# EAGLE design zilla1 (EAGLE 7.2.0)
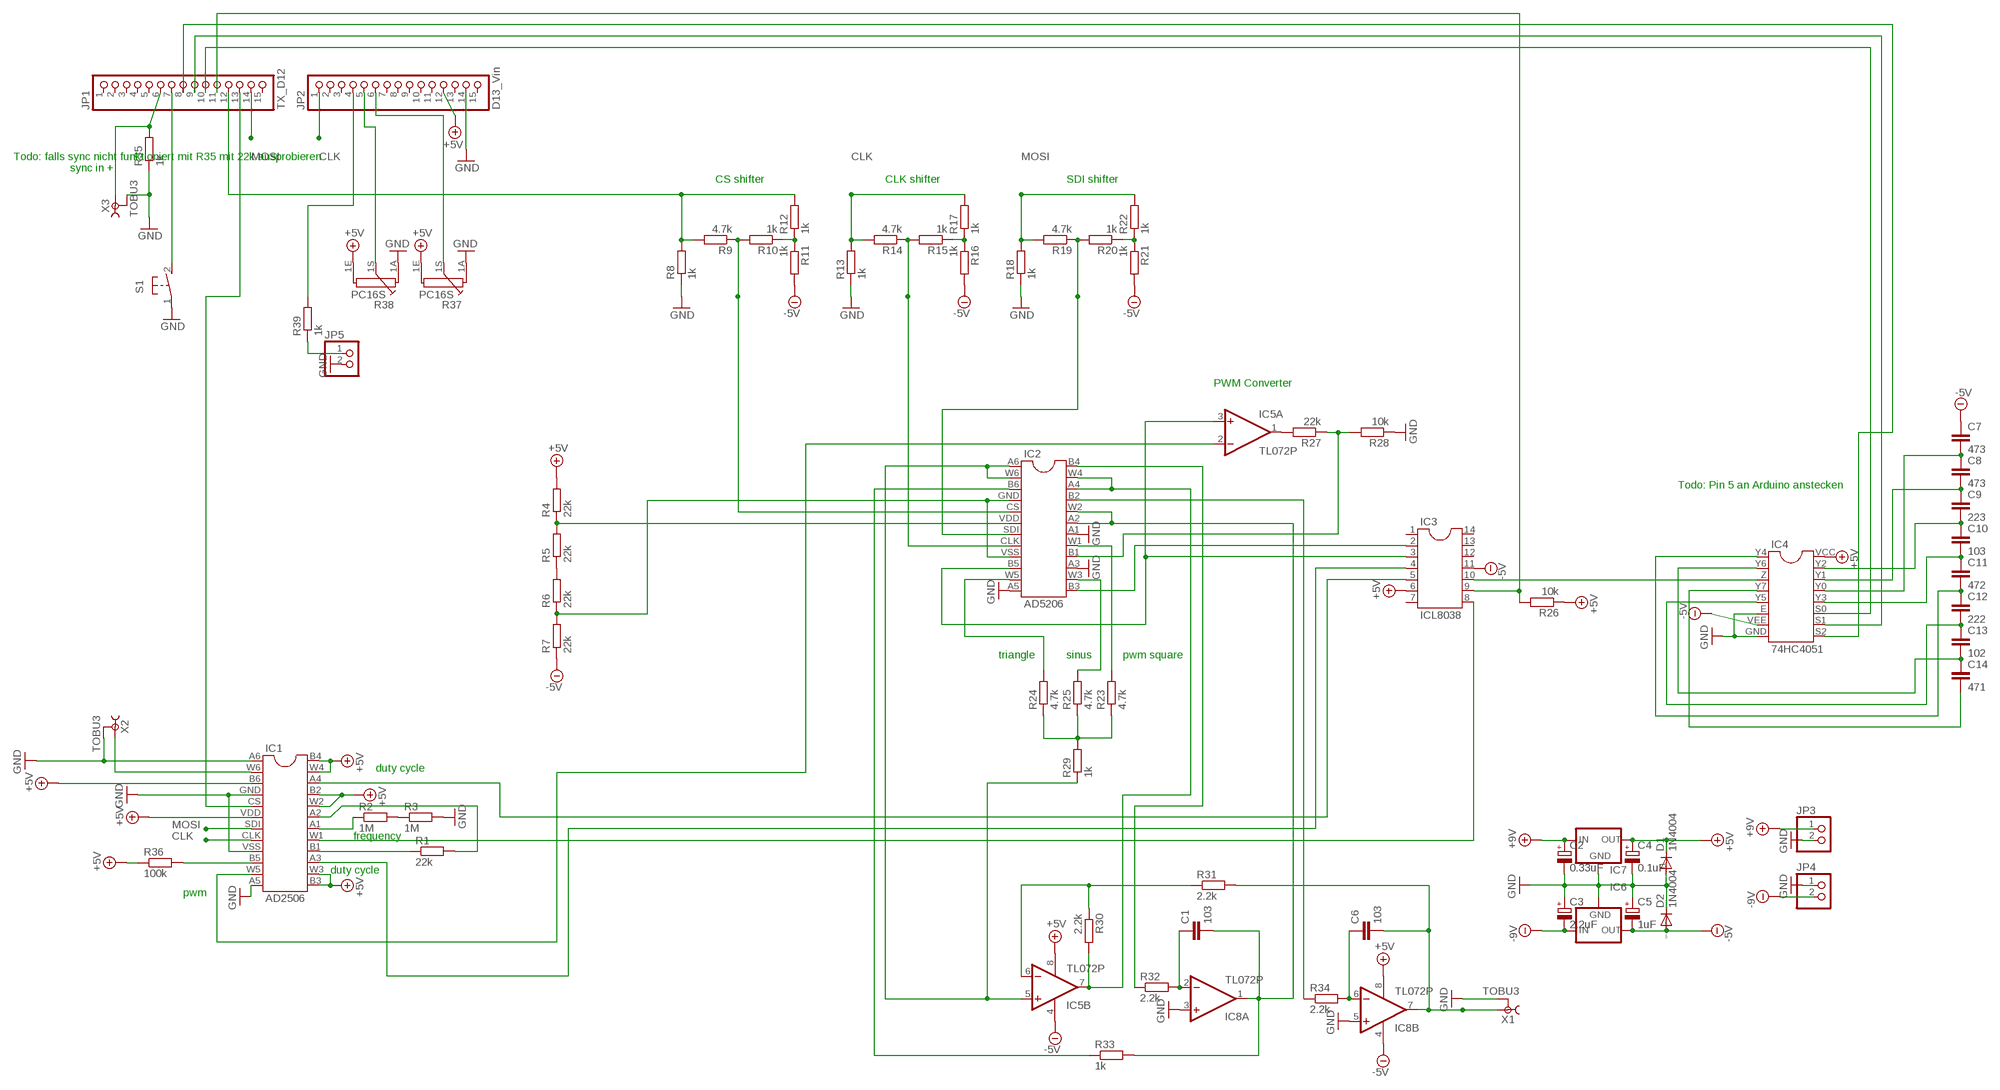
[diagram p0: schematic, sheet 1]

## Parts
C1  103  C-EU025-024X044  [C025-024X044]
C2  0.33uF  CPOL-EUE2-5  [E2-5]
C3  2.2uF  CPOL-EUE2-5  [E2-5]
C4  0.1uF  CPOL-EUE2-5  [E2-5]
C5  1uF  CPOL-EUE2-5  [E2-5]
C6  103  C-EU025-024X044  [C025-024X044]
C7  473  C-EU025-024X044  [C025-024X044]
C8  473  C-EU025-024X044  [C025-024X044]
C9  223  C-EU025-024X044  [C025-024X044]
C10  103  C-EU025-024X044  [C025-024X044]
C11  472  C-EU025-024X044  [C025-024X044]
C12  222  C-EU025-024X044  [C025-024X044]
C13  102  C-EU025-024X044  [C025-024X044]
C14  471  C-EU025-024X044  [C025-024X044]
D1  1N4004  [DO41-10]
D2  1N4004  [DO41-10]
IC1  AD2506  DIL24-3  [AD5206]
IC2  AD5206  DIL24-3  [AD5206]
IC3  ICL8038  DIL14  [DIL14]
IC4  74HC4051  DIL16  [DIL16]
IC5  TL072P  [DIL08]
IC6  79XXS  [79XXS]
IC7  78XXS  [78XXS]
IC8  TL072P  [DIL08]
JP1  TX_D12  PINHD-1X15  [1X15]
JP2  D13_Vin  PINHD-1X15  [1X15]
JP3  PINHD-1X2  [1X02]
JP4  PINHD-1X2  [1X02]
JP5  PINHD-1X2  [1X02]
R1  22k  R-EU_0207/7  [0207/7]
R2  1M  R-EU_0207/7  [0207/7]
R3  1M  R-EU_0207/7  [0207/7]
R4  22k  R-EU_0207/7  [0207/7]
R5  22k  R-EU_0207/7  [0207/7]
R6  22k  R-EU_0207/7  [0207/7]
R7  22k  R-EU_0207/7  [0207/7]
R8  1k  R-EU_0207/7  [0207/7]
R9  4.7k  R-EU_0207/7  [0207/7]
R10  1k  R-EU_0207/7  [0207/7]
R11  1k  R-EU_0207/7  [0207/7]
R12  1k  R-EU_0207/7  [0207/7]
R13  1k  R-EU_0207/7  [0207/7]
R14  4.7k  R-EU_0207/7  [0207/7]
R15  1k  R-EU_0207/7  [0207/7]
R16  1k  R-EU_0207/7  [0207/7]
R17  1k  R-EU_0207/7  [0207/7]
R18  1k  R-EU_0207/7  [0207/7]
R19  4.7k  R-EU_0207/7  [0207/7]
R20  1k  R-EU_0207/7  [0207/7]
R21  1k  R-EU_0207/7  [0207/7]
R22  1k  R-EU_0207/7  [0207/7]
R23  4.7k  R-EU_0207/7  [0207/7]
R24  4.7k  R-EU_0207/7  [0207/7]
R25  4.7k  R-EU_0207/7  [0207/7]
R26  10k  R-EU_0207/7  [0207/7]
R27  22k  R-EU_0207/7  [0207/7]
R28  10k  R-EU_0207/7  [0207/7]
R29  1k  R-EU_0207/7  [0207/7]
R30  2.2k  R-EU_0207/7  [0207/7]
R31  2.2k  R-EU_0207/7  [0207/7]
R32  2.2k  R-EU_0207/7  [0207/7]
R33  1k  R-EU_0207/7  [0207/7]
R34  2.2k  R-EU_0207/7  [0207/7]
R35  1k  R-EU_0207/7  [0207/7]
R36  100k  R-EU_0207/7  [0207/7]
R37  PC16S  [PC16S]
R38  PC16S  [PC16S]
R39  1k  R-EU_0207/7  [0207/7]
S1  31-XX  [B3F-31XX]
X1  TOBU3  [TOBU3]
X2  TOBU3  [TOBU3]
X3  TOBU3  [TOBU3]

## Nets
+5V: C4.+ D1.C IC1.B2 IC1.B3 IC1.B4 IC1.B6 IC1.VDD IC1.W2 IC1.W3 IC1.W4 IC3.6 IC4.VCC IC5.8(P:V+) IC7.OUT IC8.8(P:V+) JP2.12 R4.2 R26.1 R36.1 R37.1E R38.1E
+9V: C2.+ IC7.IN JP3.1
-5V: C5.- C7.1 D2.A IC3.11 IC4.VEE IC5.4(P:V-) IC6.OUT IC8.4(P:V-) R7.1 R11.2 R16.2 R21.2
-9V: C3.- IC6.IN JP4.2
CLK: IC1.CLK JP2.1 R13.2 R14.2 R17.2
GND: C2.- C3.+ C4.- C5.+ D1.A D2.C IC1.A5 IC1.A6(TEST) IC1.GND IC1.VSS IC2.A1 IC2.A3 IC2.A5 IC4.E IC4.GND IC6.GND IC7.GND IC8.3(A:+IN) IC8.5(B:+IN) JP2.14 JP3.2 JP4.1 JP5.2 R3.2 R8.1 R13.1 R18.1 R28.1 R35.1 R37.1A R38.1A S1.1(P) X1.2 X1.2@1 X1.2@2 X2.2 X2.2@1 X2.2@2 X3.2 X3.2@1 X3.2@2
MOSI: IC1.SDI JP1.14 R18.2 R19.2 R22.2
N$1: IC1.B1 R1.1
N$2: R2.2 R3.1
N$3: IC1.A1 R2.1
N$4: IC1.W1 IC3.8
N$5: IC2.VDD R4.1 R5.2
N$6: R5.1 R6.2
N$7: IC2.GND IC2.VSS R6.1 R7.2
N$8: JP1.12 R8.2 R9.2 R12.2
N$9: IC2.CS R9.1 R10.2
N$10: R10.1 R11.1 R12.1
N$11: IC1.CS JP1.13
N$12: IC2.B3 IC3.2
N$13: IC2.CLK R14.1 R15.2
N$14: R15.1 R16.1 R17.1
N$15: IC2.B5 IC3.3 IC5.3(A:+IN)
N$16: IC2.SDI R19.1 R20.2
N$17: R20.1 R21.1 R22.1
N$18: IC2.W3 R25.2
N$19: IC2.W5 R24.2
N$20: IC3.9 JP1.11 R26.2
N$21: IC2.W1 R23.2
N$22: R23.1 R24.1 R25.1 R29.2
N$23: IC5.1(A:OUT) R27.2
N$24: IC2.B1 R27.1 R28.2
N$25: IC3.10 IC4.Z
N$26: IC2.A6(TEST) IC2.W6(VCC) IC5.5(B:+IN) R29.1
N$27: IC4.S0 JP1.10
N$28: IC4.S1 JP1.9
N$29: IC2.A4 IC2.W4 IC5.7(B:OUT) R30.2
N$30: IC5.6(B:-IN) R30.1 R31.1
N$31: C6.1 IC8.6(B:-IN) R34.2
N$32: C1.1 IC8.2(A:-IN) R32.2
N$33: C1.2 IC2.A2 IC2.W2 IC8.1(A:OUT) R33.2
N$34: C7.2 C8.1 IC4.Y0
N$35: C6.2 IC8.7(B:OUT) R31.2 X1.1
N$36: IC2.B4 R32.1
N$37: IC2.B2 R34.1
N$38: IC2.B6 R33.1
N$39: IC1.W5 IC5.2(A:-IN)
N$40: IC1.B5 R36.2
N$41: C8.2 C9.1 IC4.Y1
N$42: C9.2 C10.1 IC4.Y2
N$43: C10.2 C11.1 IC4.Y3
N$44: C11.2 C12.1 IC4.Y4
N$45: C12.2 C13.1 IC4.Y5
N$46: C13.2 C14.1 IC4.Y6
N$47: IC4.S2 JP1.8
N$48: IC1.A3 IC3.4
N$49: IC1.A4 IC3.5
N$50: JP1.6 R35.2 X3.1
N$52: JP2.5 R38.1S
N$53: C14.2 IC4.Y7
N$54: JP2.6 R37.1S
N$55: IC1.A2 R1.2
N$56: IC1.W6(VCC) X2.1
N$57: JP1.7 S1.2(S)
N$59: JP2.4 R39.2
N$60: JP5.1 R39.1
Unconnected: IC3.1 IC3.7 IC3.12 IC3.13 IC3.14 JP1.1 JP1.2 JP1.3 JP1.4 JP1.5 JP1.15 JP2.2 JP2.3 JP2.7 JP2.8 JP2.9 JP2.10 JP2.11 JP2.13 JP2.15

## Notes on the sheet
- Todo: falls sync nicht funktioniert mit R35 mit 22k ausprobieren
- sync in +
- CS shifter | CLK shifter | SDI shifter
- PWM Converter
- Todo: Pin 5 an Arduino anstecken
- triangle | sinus | pwm square
- duty cycle
- frequency
- duty cycle
- pwm

## Library data of the parts
C1 C6-C14 = resistor:C-EU: CAPACITOR, European symbol
C2-C5 = resistor:CPOL-EU: POLARIZED CAPACITOR, European symbol
D1 D2 = diode:1N4004: DIODE general purpose rectifier, 1 A
IC1 IC2 = custom:DIL24: Dual In Line
IC3 = ic-package:DIL14: Dual In Line / Socket
IC4 = custom:DIL16: Dual In Line / Socket
IC5 IC8 = linear:TL072: OP AMP
IC6 = v-reg:79XXS: VOLTAGE REGULATOR
IC7 = v-reg:78XXS: VOLTAGE REGULATOR
JP1 JP2 = pinhead:PINHD-1X15: PIN HEADER
JP3-JP5 = pinhead:PINHD-1X2: PIN HEADER
R1-R36 R39 = resistor:R-EU_: RESISTOR, European symbol
R37 R38 = piher:PC16S: POTENTIOMETER single carbon potentiometer, 16 mm, S3ROH; OC_FARNELL: 4452940; OC_NEWARK: unknown
S1 = switch-omron:31-XX: OMRON SWITCH; MPN: B3F-3100; OC_FARNELL: 959704; OC_NEWARK: 36M3582
X1-X3 = con-hirschmann:TOBU3: Female Cinch CONNECTOR ( RCA Jack ); MF: FARNELL; MPN: TOBU 3; OC_FARNELL: 592791; OC_NEWARK: 06WX5914

## Board
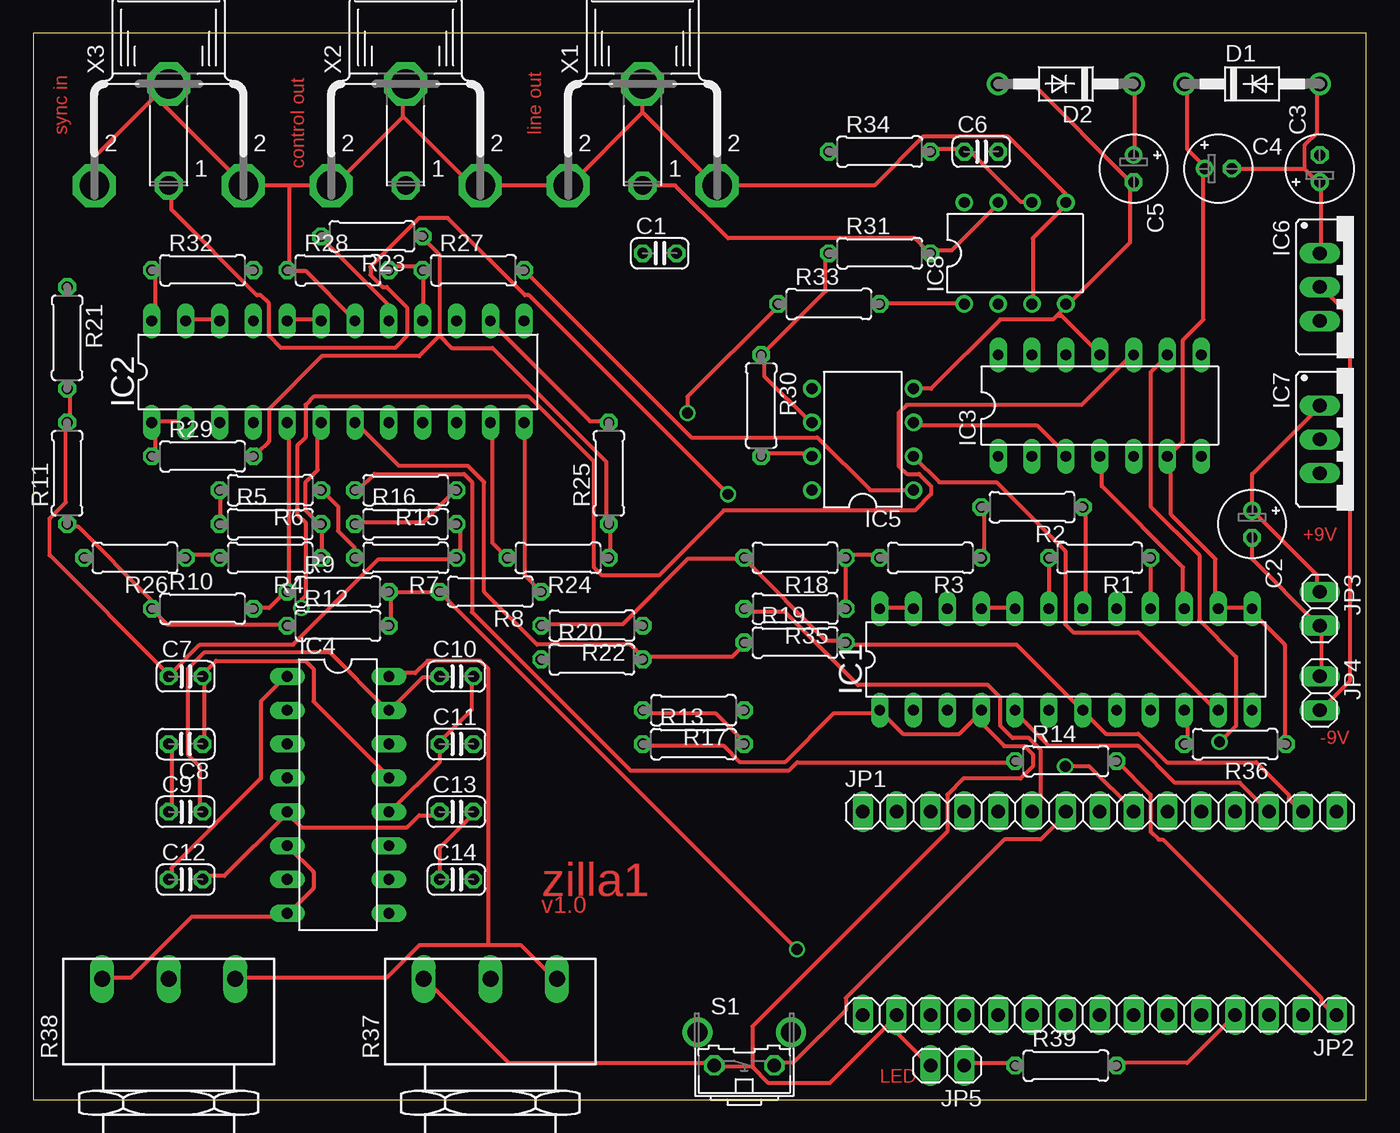
[diagram p1: board, top side]
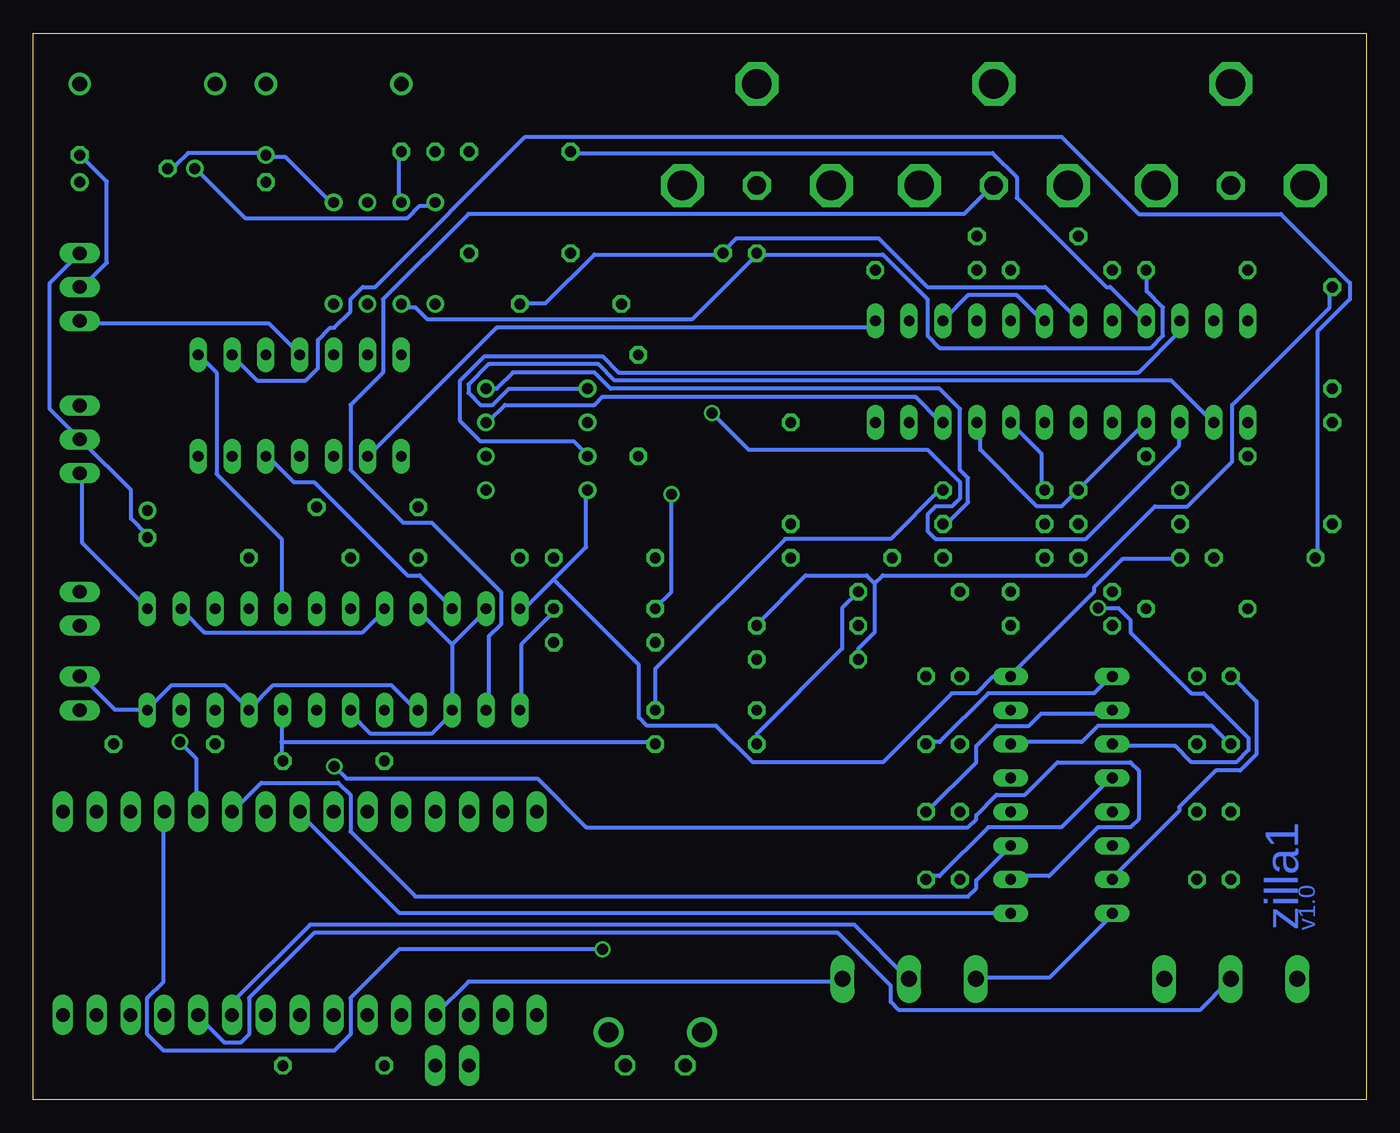
[diagram p2: board, bottom side, seen from below]

Size 100 x 80 mm. Coordinates in mm from the lower left corner, seen from the top.
Outline: 0,0 100,0 100,80 0,80 0,0
Copper layers (1*16): Top 0.035mm / dielectric 1.5mm / Bottom 0.035mm
Design rules "default *": minimum track width 12mil, minimum drill 32mil, track to track 12mil, track to pad 12mil, pad to pad 12mil, via to via 12mil, smd to smd 12mil, copper to edge 40mil, drill to drill 10mil, minimum pad ring 10mil, minimum via ring 8mil, stop-mask expansion 4mil, vias tented up to drill 0mil, thermal gap 10mil
vRestrict: area 61,5.1 to 99.1,22.9; area 7.6,52.1 to 38.1,57.1

### Footprints (pad centres in the part's own frame; a part is rotated, then mirrored left to right if it is on the bottom)
C025-024X044 = drill 0.813 octagon: 1 -1.27,0; 2 1.27,0
E2-5 = drill 0.813 pad 1.27: + -1.016,0 | drill 0.813 pad 1.27 octagon: - 1.016,0
DO41-10 = drill 1.118: A 5.08,0; C -5.08,0
AD5206 = drill 0.813 long: A1 1.27,3.81; A2 -1.27,3.81; A3 8.89,3.81; A4 -8.89,3.81; A5 13.97,-3.81; A6 -13.97,-3.81; B1 6.35,3.81; B2 -6.35,3.81; B3 13.97,3.81; B4 -13.97,3.81; B5 8.89,-3.81; B6 -8.89,-3.81; CLK 3.81,-3.81; CS -3.81,-3.81; GND -6.35,-3.81; SDI 1.27,-3.81; VDD -1.27,-3.81; VSS 6.35,-3.81; W1 3.81,3.81; W2 -3.81,3.81; W3 11.43,3.81; W4 -11.43,3.81; W5 11.43,-3.81; W6 -11.43,-3.81
DIL14 = drill 0.813 long: 1 -7.62,-3.81; 2 -5.08,-3.81; 3 -2.54,-3.81; 4 0,-3.81; 5 2.54,-3.81; 6 5.08,-3.81; 7 7.62,-3.81; 8 7.62,3.81; 9 5.08,3.81; 10 2.54,3.81; 11 0,3.81; 12 -2.54,3.81; 13 -5.08,3.81; 14 -7.62,3.81
DIL16 = drill 0.813 long: E 3.81,-3.81; GND 8.89,-3.81; S0 3.81,3.81; S1 6.35,3.81; S2 8.89,3.81; VCC -8.89,3.81; VEE 6.35,-3.81; Y0 -1.27,3.81; Y1 -3.81,3.81; Y2 -6.35,3.81; Y3 1.27,3.81; Y4 -8.89,-3.81; Y5 1.27,-3.81; Y6 -6.35,-3.81; Y7 -1.27,-3.81; Z -3.81,-3.81
DIL08 = drill 0.813 pad 1.27: 1 -3.81,-3.81; 2 -1.27,-3.81; 3 1.27,-3.81; 4 3.81,-3.81; 5 3.81,3.81; 6 1.27,3.81; 7 -1.27,3.81; 8 -3.81,3.81
79XXS = drill 1.016 long: GND -2.54,-2.54; IN 0,-2.54; OUT 2.54,-2.54
78XXS = drill 1.016 long: GND 0,-2.54; IN -2.54,-2.54; OUT 2.54,-2.54
1X15 = drill 1.016 long: 1 -17.78,0; 2 -15.24,0; 3 -12.7,0; 4 -10.16,0; 5 -7.62,0; 6 -5.08,0; 7 -2.54,0; 8 0,0; 9 2.54,0; 10 5.08,0; 11 7.62,0; 12 10.16,0; 13 12.7,0; 14 15.24,0; 15 17.78,0
1X02 = drill 1.016 long: 1 -1.27,0; 2 1.27,0
0207/7 = drill 0.813 octagon: 1 -3.81,0; 2 3.81,0
PC16S = drill 1.2 long: 1A -5,6.5; 1E 5,6.5; 1S 0,6.5
B3F-31XX = drill 1.016 octagon: 1 -2.261,-1.245; 2 2.261,-1.245 | drill 1.499 pad 2.159: 3 -3.505,1.245; 4 3.505,1.245
TOBU3 = drill 1.397 octagon: 1 0,-2.54 | drill 2.21 octagon: 2 5.588,-2.54; 2@1 -5.588,-2.54; 2@2 0,5.08

### Placement (x,y rotation side)
C1  46.99,63.5 0 top
C2  91.44,43.18 270 top
C3  96.52,69.85 90 top
C4  88.9,69.85 0 top
C5  82.55,69.85 270 top
C6  71.12,71.12 0 top
C7  11.43,31.75 0 top
C8  11.43,26.67 180 top
C9  11.43,21.59 0 top
C10  31.75,31.75 0 top
C11  31.75,26.67 0 top
C12  11.43,16.51 0 top
C13  31.75,21.59 0 top
C14  31.75,16.51 0 top
D1  91.44,76.2 0 top
D2  77.47,76.2 180 top
IC1  77.47,33.02 0 top
IC2  22.86,54.61 0 top
IC3  80.01,52.07 0 top
IC4  22.86,22.86 270 top
IC5  62.23,49.53 90 top
IC6  99.06,60.96 270 top
IC7  99.06,49.53 270 top
IC8  73.66,63.5 0 top
JP1  80.01,21.59 0 top
JP2  80.01,6.35 180 top
JP3  96.52,36.83 270 top
JP4  96.52,30.48 270 top
JP5  68.58,2.54 180 top
R1  80.01,40.64 180 top
R2  74.93,44.45 180 top
R3  67.31,40.64 180 top
R4  17.78,40.64 180 top
R5  17.78,43.18 0 top
R6  17.78,45.72 180 top
R7  27.94,40.64 180 top
R8  34.29,38.1 180 top
R9  22.86,38.1 0 top
R10  12.7,36.83 0 top
R11  2.54,46.99 90 top
R12  22.86,35.56 0 top
R13  49.53,26.67 0 top
R14  77.47,25.4 0 top
R15  27.94,45.72 180 top
R16  27.94,43.18 0 top
R17  49.53,29.21 180 top
R18  57.15,40.64 180 top
R19  57.15,34.29 0 top
R20  41.91,33.02 0 top
R21  2.54,57.15 270 top
R22  41.91,35.56 180 top
R23  25.4,64.77 180 top
R24  39.37,40.64 180 top
R25  43.18,46.99 90 top
R26  7.62,40.64 180 top
R27  33.02,62.23 0 top
R28  22.86,62.23 0 top
R29  12.7,48.26 0 top
R30  54.61,52.07 270 top
R31  63.5,63.5 0 top
R32  12.7,62.23 0 top
R33  59.69,59.69 0 top
R34  63.5,71.12 0 top
R35  57.15,36.83 180 top
R36  90.17,26.67 180 top
R37  34.29,2.54 0 top
R38  10.16,2.54 0 top
R39  77.47,2.54 0 top
S1  53.34,3.81 0 top
X1  45.72,71.12 0 top
X2  27.94,71.12 0 top
X3  10.16,71.12 0 top

### Tracks (layer width: path | path; a pad name or v marks a point on that pad's centre or on a via)
+5V
  Top 0.305: IC1.B2 71.32,36.88 73.46,36.88 IC1.W2 | IC1.B4 63.7,36.88 65.84,36.88 IC1.W4 | D1.C 86.56,76.2 86.56,71.32 87.78,70.1 C4.+ 87.78,69.8 87.78,58.52 86.26,57 86.26,49.38 85.34,48.46 IC3.6 85.34,48.16 85.34,43.89 88.7,40.54 88.7,36.88 IC1.W3 89,36.88 91.44,36.88 IC1.B3 91.44,36.58 93.88,34.14 93.88,26.82 R36.1 | R26.1 11.58,40.84 13.72,40.84 R4.2 | 34.14,11.58 36.58,11.58 39.01,9.14 R37.1E | 34.14,11.58 28.96,11.58 26.52,9.14 15.24,9.14 R38.1E | 34.14,11.58 34.14,32.31 33.53,32.92 29.57,32.92 28.65,32 26.82,32 IC4.VCC
  Bottom 0.305: 68.58,34.14 IC1.B6 68.58,28.96 70.1,27.43 74.68,27.43 76.2,28.96 IC1.VDD | 68.58,34.14 66.14,36.58 IC1.W4 | 60.96,39.01 63.4,36.58 IC1.B4 | 60.96,39.01 58.52,41.45 58.52,45.72 IC5.8 | 68.58,34.14 71.02,36.58 IC1.B2 | IC8.8 70.1,67.06 71.02,67.06 71.93,66.14 84.12,66.14 87.78,69.8 C4.+ | IC7.OUT 96.32,46.94 96.32,41.76 91.44,36.88 IC1.B3 | IC1.W2 73.76,36.58 75.29,35.05 87.17,35.05 88.7,36.58 IC1.W3 | R4.2 14.02,40.54 18.29,40.54 20.42,38.41 20.42,38.1 26.52,32 IC4.VCC 26.82,31.7 28.04,31.7 29.26,30.48 31.09,30.48 36.27,25.3 46.02,25.3 48.77,28.04 53.95,28.04 54.56,28.65 54.56,32.61 60.96,39.01 | JP2.12 67.36,8.84 39.32,8.84 R37.1E
+9V
  Top 0.305: JP3.1 96.32,38.1 96.32,39.32 C2.+ 91.44,46.94 96.32,51.82 IC7.IN
-5V
  Top 0.305: IC5.4 67.36,53.34 72.54,58.52 76.5,58.52 76.81,58.83 | 76.81,58.83 77.42,59.44 IC8.4 77.72,59.74 82.3,64.31 82.3,68.58 C5.- 82.3,68.89 74.98,76.2 D2.A | 76.81,58.83 77.11,58.83 79.86,56.08 IC3.11 | R21.2 2.74,53.34 2.74,50.9 R11.2 2.44,50.6 2.44,44.81 1.22,43.59 1.22,40.84 10.06,32 C7.1 10.36,32 12.5,34.14 19.51,34.14 25.91,40.54 31.7,40.54 R7.1 32,40.84 32,42.98 R16.2
  Bottom 0.305: IC6.OUT 96.32,58.22 82.3,58.22 80.16,56.08 IC3.11 | IC4.VEE 18.9,16.76 14.02,21.64 14.02,21.95 11.28,24.69 9.45,24.69 8.23,25.91 8.23,29.87 10.06,31.7 C7.1 | IC5.4 65.23,53.34 64.01,54.56 57.91,54.56 56.69,53.34 32,53.34 30.48,51.82 30.48,47.24 29.87,46.63 29.87,44.81 31.7,42.98 R16.2
-9V
  Top 0.305: 96.62,71.02 C3.- | JP4.2 96.62,29.26 98.75,31.39 98.75,58.83 96.62,60.96 IC6.IN
  Bottom 0.305: C3.- 96.32,70.71 94.49,68.89 94.49,62.79 96.32,60.96 IC6.IN
CLK
  Top 0.305: R17.2 45.72,28.96 51.21,28.96 53.34,26.82 R13.2 | R14.2 83.82,22.86 83.82,20.12 84.43,19.51 84.73,19.51 96.62,7.62 96.62,7.32 97.54,6.4 JP2.1
  Bottom 0.305: 81.38,26.82 81.38,28.96 IC1.CLK | 81.38,26.82 81.38,25.6 R14.2 | 81.38,26.82 53.34,26.82 R13.2
GND
  Top 0.305: 53.95,2.44 51.21,2.44 S1.1 50.9,2.74 35.66,2.74 29.57,8.84 R37.1A | 53.95,2.44 55.17,1.22 59.74,1.22 64.01,5.49 | 64.01,5.49 64.62,6.1 JP2.14 | 64.01,5.49 64.31,5.49 67.06,2.74 JP5.2 | IC4.E 21.03,17.07 21.03,15.85 19.2,14.02 IC4.GND 18.9,13.72 11.89,13.72 7.32,9.14 5.18,9.14 R38.1A | 45.72,74.07 X1.2@2 | 45.72,74.07 40.23,68.58 X1.2@1 X2.2 32.92,68.58 27.74,73.76 | 45.72,74.07 51.21,68.58 X1.2 63.09,68.58 66.75,72.24 73.15,72.24 77.42,67.97 77.42,67.36 IC8.5 77.42,67.06 74.98,64.62 74.98,59.74 IC8.3 | X3.2@1 4.57,70.71 9.14,75.29 | 9.14,75.29 10.06,76.2 X3.2@2 9.14,75.29 | IC2.A1 24.08,58.52 20.42,62.18 19.2,62.18 R28.1 19.2,62.48 19.2,68.58 | 19.2,68.58 X2.2@1 22.55,68.58 27.74,73.76 | 19.2,68.58 15.85,68.58 | 27.74,73.76 27.74,76.2 X2.2@2 | 15.85,68.58 9.14,75.29 | 15.85,68.58 X3.2 | IC6.GND 96.62,63.7 96.62,68.58 C3.+ 96.32,68.89 95.4,69.8 | 95.4,69.8 89.92,69.8 C4.- | 95.4,69.8 95.4,71.63 96.32,72.54 96.32,76.2 D1.A | C5.+ 82.6,71.02 82.6,76.2 D2.C | R8.1 36.88,39.32 36.88,50.6 IC2.A5 | R3.2 63.4,40.84 60.96,40.84 R18.1 R35.1 | 70.71,28.65 69.49,27.43 65.23,27.43 63.7,28.96 IC1.A6 63.4,28.96 60.05,28.96 56.39,25.3 53.03,25.3 51.82,26.52 45.72,26.52 R13.1 | 70.71,28.65 71.02,28.96 IC1.GND 70.71,28.65 | C2.- 91.44,40.54 96.32,35.66 JP3.2 96.62,35.36 96.62,32 JP4.1 | 53.95,2.44 53.95,5.49 68.58,20.12 68.58,22.86 69.8,24.08 74.07,24.08 74.98,24.99 74.98,25.91 74.37,26.52 72.85,26.52 70.71,28.65
  Bottom 0.305: R37.1A 29.26,9.14 23.77,9.14 19.2,13.72 IC4.GND | IC2.A3 31.7,58.52 29.87,60.35 26.21,60.35 24.38,58.52 IC2.A1 | IC8.5 77.72,67.36 81.08,70.71 82.3,70.71 C5.+ 82.6,71.02 88.39,71.02 89.31,70.1 89.92,70.1 C4.- | R13.1 45.72,27.43 39.32,33.83 39.32,36.88 R8.1 | IC1.A6 63.4,29.26 63.4,34.14 60.96,36.58 R35.1 | 83.82,29.26 85.65,31.09 89.61,31.09 91.44,29.26 | C2.- 91.44,42.37 92.66,43.59 92.66,45.72 96.32,49.38 IC7.GND 96.62,49.68 98.75,51.82 98.75,61.27 IC6.GND | 91.44,29.26 93.88,29.26 96.32,31.7 JP4.1 | 91.44,29.26 IC1.A5 | 83.82,29.26 81.99,31.09 73.15,31.09 71.32,29.26 IC1.GND | 83.82,29.26 IC1.VSS
MOSI
  Top 0.305: 53.34,40.54 59.44,34.44 60.96,34.44 R19.2 60.96,34.14 73.76,34.14 78.64,29.26 IC1.SDI 78.94,28.96 80.47,27.43 82.91,27.43 85.04,25.3 91.75,25.3 94.18,22.86 94.18,22.55 95.1,21.64 JP1.14 | 53.34,40.54 49.07,40.54 44.2,35.66 38.1,35.66 R22.2 | 53.34,40.54 R18.2
N$1
  Top 0.305: R1.1 IC1.B1
N$2
  Top 0.305: R3.1 71.32,40.84 71.32,44.2 R2.2
N$3
  Top 0.305: IC1.A1 78.94,36.88 78.94,44.2 R2.1
N$4
  Bottom 0.305: IC1.W1 81.38,36.88 81.38,42.06 86.26,46.94 86.26,54.56 87.48,55.78 IC3.8
N$5
  Top 0.305: R4.1 21.64,40.84 21.64,42.98 R5.2 21.34,43.28 20.42,44.2 20.42,46.33 21.34,47.24 21.34,50.6 IC2.VDD
N$6
  Top 0.305: R5.1 14.02,43.28 14.02,45.72 R6.2
N$7
  Top 0.305: R7.2 24.08,40.84 24.08,41.45 22.86,42.67 22.86,44.5 21.64,45.72 R6.1
  Bottom 0.305: 21.64,45.72 16.76,50.6 IC2.GND | 21.64,45.72 22.86,44.5 24.69,44.5 28.96,48.77 28.96,50.6 IC2.VSS | 21.64,45.72 R6.1
N$8  (via drill 0.81)
  Top 0.305: 26.82,38.1 26.82,35.66 R12.2 | 26.82,38.1 R8.2 v57.3,11.28 | 26.82,38.1 R9.2
  Bottom 0.305: v57.3,11.28 72.54,11.28 76.2,7.62 76.2,4.88 77.42,3.66 90.22,3.66 91.44,4.88 91.44,7.62 90.22,8.84 90.22,21.34 JP1.12
N$9
  Top 0.305: R10.2 16.76,36.88 17.68,36.88 18.9,38.1 R9.1 19.2,38.1 19.2,50.6 IC2.CS
N$10
  Top 0.305: 19.2,35.66 R12.1 18.9,35.66 10.06,35.66 R10.1 8.84,36.88 8.84,37.49 3.35,42.98 2.74,42.98 R11.1
N$11
  Top 0.305: JP1.13 90.53,23.77 85.65,23.77 82.91,26.52 76.2,26.52 73.76,28.96 IC1.CS
N$12
  Bottom 0.305: IC3.2 74.68,48.46 65.23,57.91 37.19,57.91 36.88,58.22 IC2.B3
N$13
  Top 0.305: R14.1 73.46,25.3 57.3,25.3 56.69,24.69 44.81,24.69 32.92,36.58 32.92,46.33 32.31,46.94 25.6,46.94 24.38,45.72 R15.2
  Bottom 0.305: R15.2 24.38,45.72 24.38,48.46 26.52,50.6 IC2.CLK
N$14
  Top 0.305: 53.34,29.26 R17.1 | R16.1 24.38,43.28 29.26,43.28 31.7,45.72 R15.1
  Bottom 0.305: R17.1 53.34,32.31 43.59,42.06 35.66,42.06 32,45.72 R15.1
N$15
  Top 0.305: IC3.3 77.42,48.46 75.29,50.6 66.14,50.6 IC5.3
  Bottom 0.305: IC2.B5 32,50.9 33.83,52.73 57.3,52.73 57.91,52.12 64.62,52.12 65.84,50.9 IC5.3
N$16
  Top 0.305: 45.72,33.22 52.43,33.22 53.34,34.14 R19.1 | 45.72,33.22 44.81,34.14 37.8,34.14 33.83,38.1 33.83,46.33 32.61,47.55 27.43,47.55 24.38,50.6 IC2.SDI | 45.72,33.22 R20.2
N$17
  Top 0.305: 45.72,35.66 R22.1
  Bottom 0.305: R20.1 38.1,33.83 36.88,35.05 36.88,38.71 | 36.88,38.71 37.49,39.32 42.06,39.32 45.72,35.66 R22.1 | 36.88,38.71 36.27,39.32 21.03,39.32 15.85,44.5 13.41,44.5 10.06,47.85 10.06,52.12 2.74,59.44 2.74,60.96 R21.1
N$18
  Top 0.305: R25.2 42.98,50.9 41.76,50.9 34.44,58.22 IC2.W3
N$19
  Top 0.305: R24.2 34.44,41.76 34.44,50.6 IC2.W5
N$20  (via drill 0.81)
  Top 0.305: v89,26.82 90.22,28.04 90.22,33.22 87.48,35.97 87.48,40.84 83.82,44.5 83.82,54.56 85.04,55.78 IC3.9
  Bottom 0.305: R26.2 3.66,40.84 3.66,57.61 1.22,60.05 1.22,61.27 6.4,66.45 17.07,66.45 22.86,72.24 63.09,72.24 74.37,60.96 75.29,60.96 76.2,60.05 76.2,59.13 77.42,57.91 77.72,57.91 78.64,57 78.64,54.86 79.55,53.95 83.21,53.95 85.04,55.78 IC3.9 | v89,26.82 87.78,25.6 87.78,21.64 JP1.11
N$21
  Top 0.305: IC2.W1 26.52,58.52 26.52,59.74 21.64,64.62 R23.2
N$22
  Top 0.305: R24.1 43.28,40.84 43.28,42.98 R25.1 42.98,43.28 42.98,47.85 34.44,56.39 31.39,56.39 30.48,57.3 | 30.48,57.3 28.96,55.78 21.64,55.78 17.68,51.82 17.68,49.38 16.76,48.46 R29.2 | 30.48,57.3 30.48,63.4 29.26,64.62 R23.1
N$23
  Top 0.305: IC5.1 62.79,45.72 58.83,49.68 49.38,49.68 R27.2
N$24
  Top 0.305: R28.2 26.82,62.48 28.96,62.48 R27.1 29.26,62.18 29.26,58.52 IC2.B1
N$25  (via drill 0.81)
  Top 0.305: v20.12,36.88 20.12,37.49 20.42,37.8 20.42,43.28 19.81,43.89 19.81,49.07 20.42,49.68 20.42,52.12 21.03,52.73 37.19,52.73 42.06,47.85 42.06,39.93 42.67,39.32 46.94,39.32 51.82,44.2 66.14,44.2 67.36,45.41 67.36,46.02 66.45,46.94 65.53,46.94 64.92,47.55 64.92,51.51 65.53,52.12 78.64,52.12 82.3,55.78 IC3.10
  Bottom 0.305: v20.12,36.88 18.59,36.88 17.68,35.97 17.68,35.05 13.11,30.48 12.19,30.48 8.84,27.13 8.84,26.21 9.75,25.3 13.11,25.3 14.33,26.52 18.9,26.52 IC4.Z
N$26
  Top 0.305: R29.1 9.14,48.46 9.14,50.6 IC2.A6 9.14,50.9 11.28,50.9 IC2.W6
  Bottom 0.305: IC5.5 64.31,53.34 65.53,52.12 66.45,52.12 67.36,53.03 67.36,53.65 65.84,55.17 57.61,55.17 56.39,53.95 14.63,53.95 11.58,50.9 IC2.W6
N$27
  Bottom 0.305: IC4.S0 29.26,16.46 29.26,15.85 29.87,15.24 71.32,15.24 76.2,20.12 76.2,22.86 77.11,23.77 82.91,23.77 JP1.10
N$28  (via drill 0.81)
  Top 0.305: v77.42,24.99 79.25,24.99 82.6,21.64 JP1.9
  Bottom 0.305: v77.42,24.99 76.5,24.08 62.18,24.08 58.52,20.42 29.87,20.42 29.26,21.03 29.26,21.34 27.74,22.86 25.6,22.86 23.16,25.3 17.68,25.3 17.07,24.69 17.07,21.03 17.68,20.42 20.12,20.42 23.77,16.76 26.52,16.76 IC4.S1
N$29
  Top 0.305: IC2.W4 11.58,58.52 13.72,58.52 IC2.A4 | R30.2 54.86,48.46 58.22,48.46 IC5.7
  Bottom 0.305: IC2.A4 14.02,58.22 14.02,57.61 17.07,54.56 56.08,54.56 57.3,55.78 66.14,55.78 67.97,53.95 67.97,50.9 66.45,49.38 59.44,49.38 58.52,48.46 IC5.7
N$30
  Top 0.305: IC5.6 58.22,50.9 54.86,54.25 54.86,55.78 R30.1 54.86,56.08 59.44,60.66 59.44,63.4 R31.1
N$31
  Top 0.305: IC8.6 74.68,67.36 74.07,67.36 70.1,71.32 C6.1 69.8,71.32 67.36,71.32 R34.2
N$32
  Bottom 0.305: 45.72,63.4 36.27,63.4 32.92,60.05 32.92,57.3 32,56.39 16.15,56.39 15.24,57.3 15.24,59.44 16.46,60.66 16.46,62.18 R32.2 | 45.72,63.4 50.6,58.52 70.41,58.52 71.32,59.44 72.24,59.44 IC8.2 | 45.72,63.4 C1.1
N$33
  Top 0.305: IC2.W2 19.2,58.52 21.34,58.52 IC2.A2 | IC8.1 69.8,59.74 63.7,59.74 R33.2
  Bottom 0.305: R33.2 63.4,59.74 61.57,59.74 57.91,63.4 48.46,63.4 C1.2 48.16,63.7 47.24,64.62 36.58,64.62 32.92,60.96 24.08,60.96 21.64,58.52 IC2.A2
N$34
  Top 0.305: C8.1 12.8,26.82 12.8,31.7 C7.2 12.8,32 13.72,32.92 20.42,32.92 21.03,32.31 21.03,29.87 26.52,24.38 IC4.Y0
N$35
  Top 0.305: IC8.7 72.24,67.06 68.89,63.7 67.36,63.7 R31.2 67.06,63.7 66.14,64.62 52.12,64.62 48.16,68.58 X1.1
  Bottom 0.305: C6.2 72.54,71.02 72.54,67.36 IC8.7
N$36
  Top 0.305: IC2.B4 9.14,58.52 9.14,62.18 R32.1
N$37
  Bottom 0.305: IC2.B2 16.76,58.52 19.2,60.96 19.51,60.96 26.21,67.67 26.21,69.19 28.04,71.02 59.44,71.02 R34.1
N$38  (via drill 0.81)
  Top 0.305: v49.07,51.51 49.07,52.73 55.78,59.44 R33.1
  Bottom 0.305: v49.07,51.51 46.33,48.77 32.92,48.77 30.48,46.33 30.48,45.11 31.09,44.5 32.31,44.5 32.92,43.89 32.92,42.67 32.31,42.06 21.03,42.06 14.02,49.07 14.02,50.6 IC2.B6
N$39
  Top 0.305: IC5.2 67.97,46.33 72.24,46.33 77.42,41.15 77.42,35.66 78.03,35.05 82.91,35.05 88.7,29.26 IC1.W5
N$40
  Top 0.305: R36.2 86.56,26.82 86.56,28.96 IC1.B5
N$41
  Top 0.305: C9.1 10.36,21.64 10.36,26.52 C8.2
  Bottom 0.305: IC4.Y1 26.52,26.82 21.34,26.82 20.12,28.04 11.58,28.04 10.36,26.82 C8.2
N$42
  Top 0.305: C9.2 12.5,21.64 12.5,24.99 11.58,25.91 11.58,32.31 12.8,33.53 22.25,33.53 26.52,29.26 IC4.Y2 26.82,29.26 29.26,31.7 30.48,31.7 C10.1
N$43
  Top 0.305: IC4.Y3 26.82,21.64 30.48,25.3 C11.1 30.48,26.82 32.92,29.26 32.92,31.7 C10.2
N$44
  Top 0.305: C12.1 10.36,16.76 10.36,17.37 17.07,24.08 17.07,29.87 18.9,31.7 IC4.Y4
  Bottom 0.305: C11.2 32.92,26.82 32,26.82 28.35,30.48 20.42,30.48 19.2,31.7 IC4.Y4
N$45
  Top 0.305: C12.2 12.8,16.76 14.33,16.76 18.9,21.34 IC4.Y5 19.2,21.34 20.12,20.42 28.04,20.42 28.96,21.34 30.48,21.34 C13.1
N$46
  Top 0.305: C14.1 30.48,18.9 32.92,21.34 C13.2
  Bottom 0.305: IC4.Y6 19.2,28.96 24.38,28.96 25.3,28.04 27.74,28.04 29.26,26.52 29.26,25.3 32.92,21.64 C13.2
N$47
  Bottom 0.305: IC4.S2 26.82,14.02 72.54,14.02 79.86,21.34 JP1.8
N$48
  Top 0.305: IC3.4 80.16,48.16 80.16,46.02 86.26,39.93 86.26,36.88 IC1.A3
N$49
  Bottom 0.305: IC1.A4 68.58,36.88 71.02,39.32 71.93,39.32 78.94,46.33 80.47,46.33 82.3,48.16 IC3.5
N$50  (via drill 0.81)
  Top 0.305: JP1.6 75.59,22.25 75.59,26.21 74.68,27.13 73.46,27.13 72.54,28.04 72.54,30.18 71.63,31.09 61.87,31.09 56.39,36.58 53.34,36.58 R35.2 | v52.12,45.41 37.19,60.35 36.88,60.35 31.09,66.14 28.96,66.14 25.3,62.48 25.3,61.87 26.21,60.96 26.52,60.96 28.04,59.44 28.04,57.3 27.13,56.39 18.59,56.39 17.68,57.3 17.68,59.74 17.07,60.35 16.76,60.35 10.36,66.75 10.36,68.58 X3.1
  Bottom 0.305: v52.12,45.41 52.12,38.1 53.34,36.88 R35.2
N$52
  Bottom 0.305: JP2.5 87.48,6.1 85.65,4.27 84.43,4.27 83.82,4.88 83.82,7.62 78.94,12.5 39.62,12.5 35.66,8.53 35.66,7.32 35.05,6.71 12.5,6.71 10.36,8.84 R38.1S
N$53
  Bottom 0.305: C14.2 32.92,16.76 32,16.76 28.35,20.42 22.86,20.42 19.2,24.08 IC4.Y7
N$54
  Bottom 0.305: JP2.6 85.04,6.4 85.04,7.32 79.25,13.11 38.41,13.11 34.44,9.14 R37.1S
N$55
  Top 0.305: R1.2 IC1.A2
N$56
  Bottom 0.305: IC1.W6 65.84,29.26 65.84,34.75 64.92,35.66 64.92,38.1 70.1,43.28 72.24,43.28 76.2,47.24 76.2,52.12 73.76,54.56 73.76,60.05 67.36,66.45 30.18,66.45 28.04,68.58 X2.1
N$57
  Top 0.305: S1.2 55.78,2.74 57,2.74 60.96,6.71 60.96,7.62 72.85,19.51 75.59,19.51 77.42,21.34 JP1.7
N$59
  Top 0.305: JP2.4 86.56,2.74 81.38,2.74 R39.2
N$60
  Top 0.305: R39.1 73.46,2.74 70.1,2.74 JP5.1

### Text on the board
Top: sync in | line out | control out | +9V | -9V | zilla1 | v1.0 | LED
Bottom: v1.0 | zilla1